# Altium schematic sheet TOF_20260204版本.SchDoc
size A3; SheetNumber: 1; SheetTotal: 1
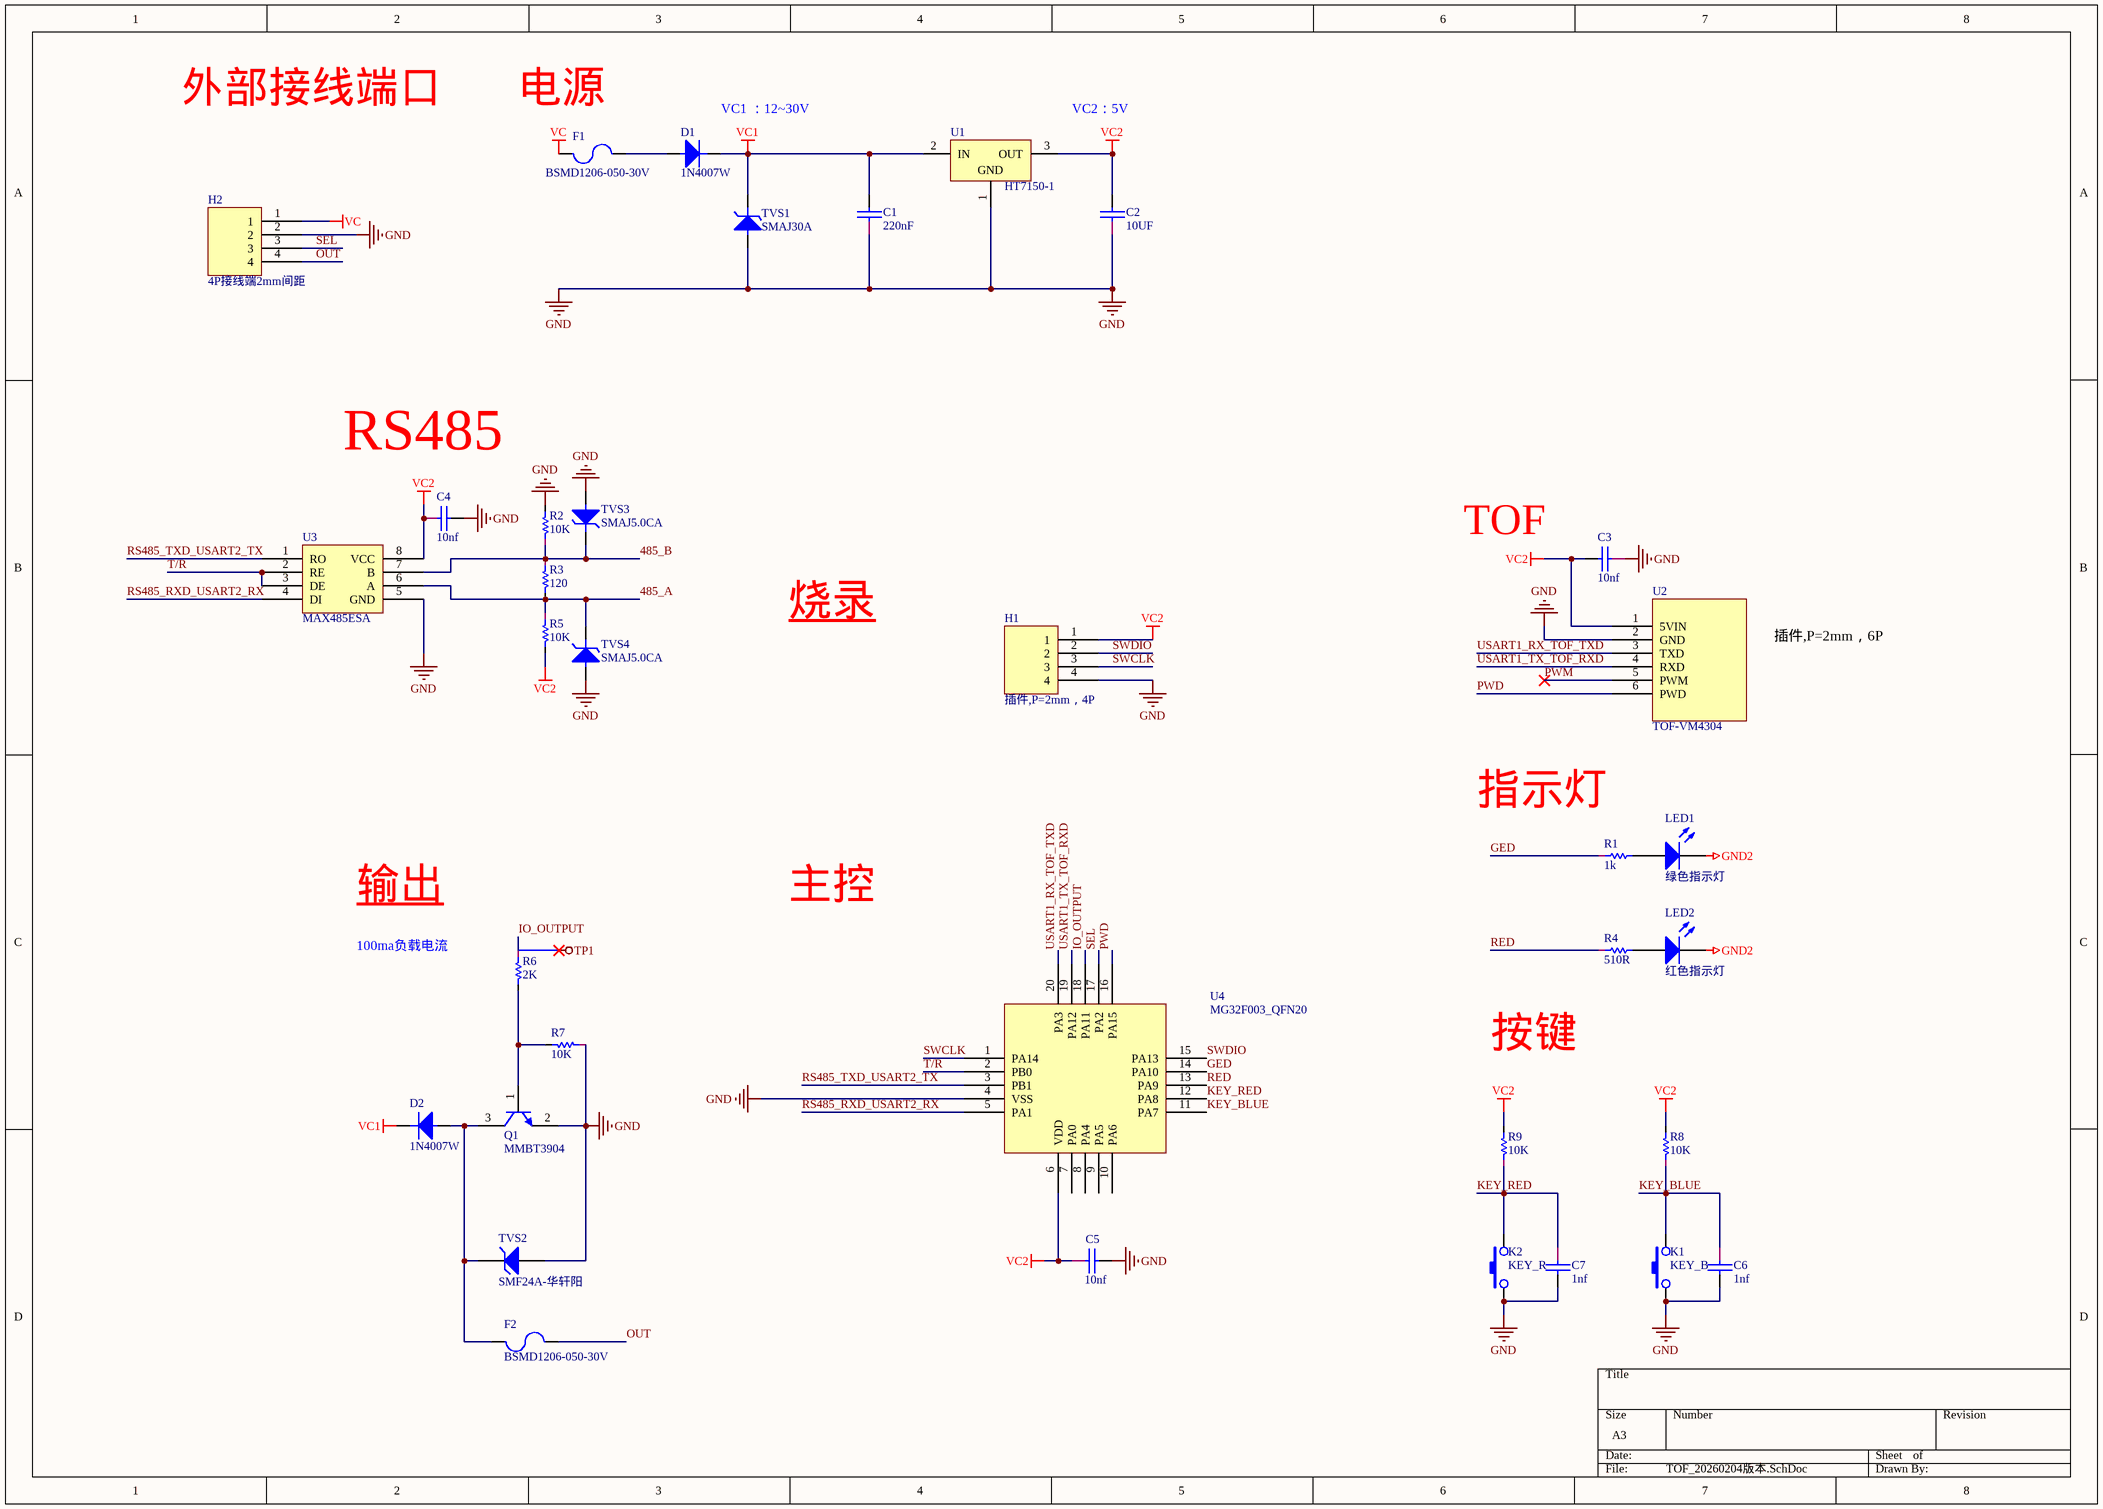
[diagram p0: TOF_20260204版本.SchDoc]

## Parts
C1  220nF  [0603A]
C2  10UF  [0603A]
C3  10nf  [0603A]
C4  10nf  [0603A]
C5  10nf  [0603A]
C6  1nf  [0603A]
C7  1nf  [0603A]
D1  1N4007W  [D1]
D2  1N4007W  [D1]
F1  BSMD1206-050-30V  [1206]
F2  BSMD1206-050-30V  [1206]
H1  插件,P=2mm，4P  [Pin HDR1X4/2.54mm-S]
H2  4P接线端2mm间距  [Pin HDR1X4/2.54mm-S]
K1  KEY_B  [DIP-3X6X4.3]
K2  KEY_R  [DIP-3X6X4.3]
LED1  绿色指示灯  [3.2X1.6X1.1]
LED2  红色指示灯  [3.2X1.6X1.1]
Q1  MMBT3904  [TO-226-AA]
R1  1k  [0603]
R2  10K  [0603]
R3  120  [0603]
R4  510R  [0603]
R5  10K  [0603]
R6  2K  [0603]
R7  10K  [0603]
R8  10K  [0603]
R9  10K  [0603]
TVS1  SMAJ30A  [D2]
TVS2  SMF24A-华轩阳  [GLZZ0002ZA-A]
TVS3  SMAJ5.0CA  [D2]
TVS4  SMAJ5.0CA  [D2]
U1  HT7150-1  [SOT89N]
U2  TOF-VM4304  [Pin HDR1X6/2.54mm-W]
U3  MAX485ESA  [KF2EDGK-2.54-10P]
U4  MG32F003_QFN20  [HT3.96-11P]

## Nets
GND: C1.2 C2.2 C3.2 C4.1 C5.1 C6.1 C7.1 H1.4 H2.2 K1.3 K2.3 Q1.2(E) R2.1 R7.2 TVS1.1 TVS2.2(A) TVS3.1 TVS4.1 U1.1(GND) U2.2(GND) U3.5(GND) U4.4(VSS)
GND2: LED1.2(K) LED2.2(K)
VC: F1.2 H2.1
VC1: C1.1 D1.2(K) D2.2(K) TVS1.2 U1.2(IN)
VC2: C2.1 C3.1 C4.2 C5.2 H1.1 R5.1 R8.1 R9.1 U1.3(OUT) U2.1(5VIN) U3.8(VCC) U4.6(VDD)
485_A: R3.1 R5.2 TVS4.2 U3.6(A)
485_B: R2.2 R3.2 TVS3.2 U3.7(B)
GED: R1.2 U4.14(PA10)
IO_OUTPUT: R6.2 U4.18(PA11)
KEY_BLUE: C6.2 K1.1 R8.2 U4.11(PA7)
KEY_RED: C7.2 K2.1 R9.2 U4.12(PA8)
OUT: F2.2 H2.4
PWD: U2.6(PWD) U4.16(PA15)
PWM: U2.5(PWM)
RED: R4.2 U4.13(PA9)
RS485_RXD_USART2_RX: U3.4(DI) U4.5(PA1)
RS485_TXD_USART2_TX: U3.1(RO) U4.3(PB1)
SEL: H2.3 U4.17(PA2)
SWCLK: H1.3 U4.1(PA14)
SWDIO: H1.2 U4.15(PA13)
T/R: U3.2(RE) U3.3(DE) U4.2(PB0)
USART1_RX_TOF_TXD: U2.3(TXD) U4.20(PA3)
USART1_TX_TOF_RXD: U2.4(RXD) U4.19(PA12)
NetD1_1: D1.1(A) F1.1
NetD2_1: D2.1(A) F2.1 Q1.3(C) TVS2.1(K)
NetLED1_1: LED1.1(A) R1.1
NetLED2_1: LED2.1(A) R4.1
NetQ1_1: Q1.1(B) R6.1 R7.1

Not connected (* = marked no-connect by the designer): U4 7(PA0) 8(PA4) 9(PA5) 10(PA6)

## Notes on the sheet
- 外部接线端口 < >
- (near F1) 电源 < >
- (near D1) VC1 ：12~30V
- VC2：5V
- RS485
- TOF
- 烧录 < >
- 插件,P=2mm，6P
- 指示灯 < >
- 输出 < >
- 主控
- (near R6) 100ma负载电流
- 按键 < >
- Labels drawn without touching a wire or pin: TP1

## Library data of the parts
C1 C2 = CAP: Capacitor
C3-C7 = CAP: 陶瓷电容
D1 D2 = DIODE
F1 F2 = FUSE
H1 = 4P接线端2mm间距
K1 K2 = KEY
LED1 LED2 = LED2: Typical RED, GREEN, YELLOW, AMBER GaAs LED; Published: 8-Jun-2000; LatestRevisionDate: 17-Jul-2002; LatestRevisionNote: Re-released for DXP Platform.; PackageVersion: Feb-2002; PackageReference: 3.2X1.6X1.1; Publisher: Altium Limited; PackageDescription: SM LED; 2 Flat Leads
Q1 = NPN: NPN Bipolar Transistor; Published: 8-Jun-2000; LatestRevisionDate: 17-Jul-2002; LatestRevisionNote: Re-released for DXP Platform.; PackageReference: TO-226-AA; Publisher: Altium Limited; PackageDescription: TO, Flat Index; 3 In-Line, Axial Leads; Body Dia. 4.8mm; Leads 0.55 x 0.51 mm (max); Code_JEDEC: TO-226-AA
R1-R9 = RAS
TVS1 TVS3 TVS4 = DIODE V: Varactor Diode
TVS2 = HZK20: Silicon Epitaxial Planar Zener Diodes for Stabilized Power Supply; Published: 12-Feb-2010; DatasheetVersion: Rev.3.00, May-2003; PackageVersion: Aug-2005; PackageReference: GLZZ0002ZA-A; Publisher: Altium Limited; PackageDescription: Metal Electrode Face (MELF) Diode; Body 3.5 x 1.35 mm (LxDia); ComponentLink1Description: Manufacturer Link; ComponentLink1URL: http://sg.renesas.com/fmwk.jsp?cnt=diode_landing.jsp&fp=/products/discrete/diodes/; ComponentLink2Description: Datasheet; ComponentLink2URL: http://documentation.renesas.com/eng/products/diode/rej03g0018_hzk.pdf; ComponentLink3Description: Packaging Specification; ComponentLink3URL: http://sg.renesas.com/media/products/common_info/package/pdf/diode/code/glzz0002za_a.pdf
U1 = HT7530-1: 3.0V 100mA Low Power,  Low Dropout Voltage (LDO) Regulator; Published: 30-Mar-2007; DatasheetVersion: rev1.50, Jan-2006; PackageVersion: Jan-2006; PackageReference: SOT-89; Publisher: Altium Limited; PackageDescription: 3-Pin SOT-89 Package 1.5 mm Pitch, 4.1 mm Lead Span; Code_IPC: SOT89; ComponentLink1Description: Manufacturer Link; ComponentLink1URL: http://www.holtek.com/; ComponentLink2Description: Datasheet; ComponentLink2URL: http://www.holtek.com/pdf/consumer/75xx_1v150.pdf
U4 = MG32F003-QFN20: QFN20主控芯片